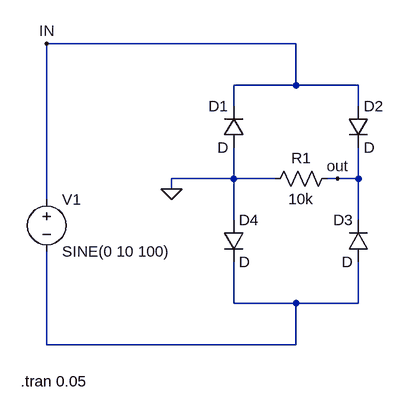
[diagram p0: schematic Full_wave_rectifier.asc]
Full_wave_rectifier.asc, the LTspice schematic file:
Version 4.1
SHEET 1 880 680
WIRE 464 -128 80 -128
WIRE 464 -64 464 -128
WIRE 464 -64 368 -64
WIRE 560 -64 464 -64
WIRE 368 -32 368 -64
WIRE 560 -32 560 -64
WIRE 368 80 368 32
WIRE 368 80 272 80
WIRE 432 80 368 80
WIRE 528 80 512 80
WIRE 560 80 560 32
WIRE 560 80 528 80
WIRE 272 96 272 80
WIRE 80 112 80 -128
WIRE 368 144 368 80
WIRE 560 144 560 80
WIRE 368 272 368 208
WIRE 464 272 368 272
WIRE 560 272 560 208
WIRE 560 272 464 272
WIRE 80 336 80 192
WIRE 464 336 464 272
WIRE 464 336 80 336
FLAG 80 -128 IN
FLAG 528 80 out
FLAG 272 96 0
SYMBOL voltage 80 96 R0
WINDOW 123 0 0 Left 0
WINDOW 39 0 0 Left 0
SYMATTR InstName V1
SYMATTR Value SINE(0 10 100)
SYMBOL diode 544 -32 R0
SYMATTR InstName D2
SYMBOL diode 352 144 R0
SYMATTR InstName D4
SYMBOL diode 576 208 R180
WINDOW 0 24 64 Left 2
WINDOW 3 24 0 Left 2
SYMATTR InstName D3
SYMBOL diode 384 32 R180
WINDOW 0 24 64 Left 2
WINDOW 3 24 0 Left 2
SYMATTR InstName D1
SYMBOL res 528 64 R90
WINDOW 0 0 56 VBottom 2
WINDOW 3 32 56 VTop 2
SYMATTR InstName R1
SYMATTR Value 10k
TEXT 40 392 Left 2 !.tran 0.05

The netlist it stands for:
* Full_wave_rectifier.asc
V1 IN N001 SINE(0 10 100)
D2 IN out D
D4 0 N001 D
D3 N001 out D
D1 0 IN D
R1 out 0 10k
.model D D
.lib standard.dio
.tran 0.05
.backanno
.end

* Results of the author's LTspice run, read from the files saved beside the schematic
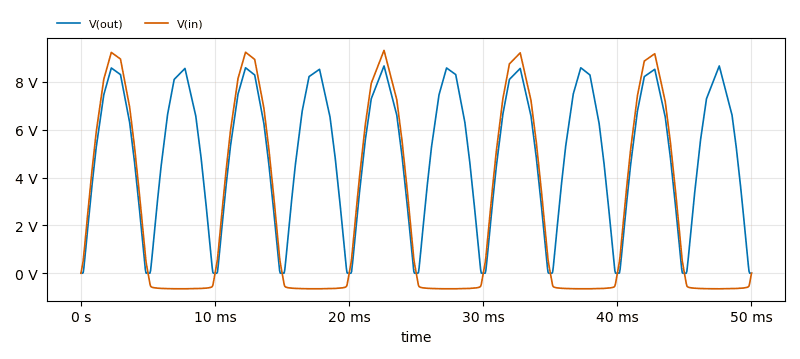
[diagram p1: Transient Analysis of Full_wave_rectifier.asc, plotted from the saved traces]
* Transient Analysis, 1 run:
*   V(out): min 0 V, max 8.67 V, average 5.068 V, rms 5.86 V, last 0 V
*   V(in): min -651.5 mV, max 9.322 V, average 2.534 V, rms 4.562 V, last 0 V